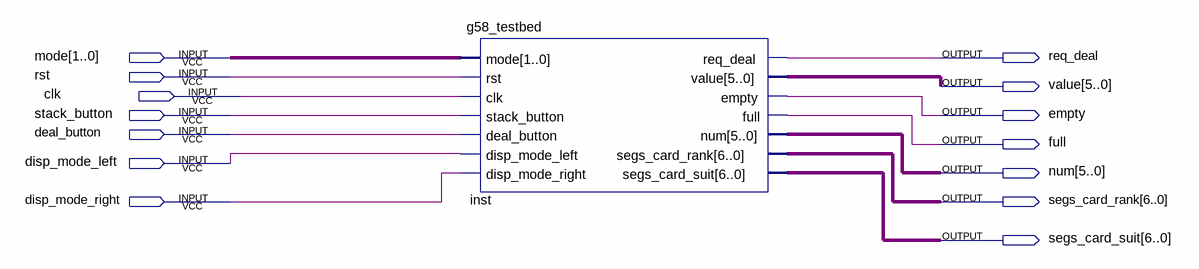
[diagram p0: schematic sheet]
// Quartus schematic g58_lab4.bdf as structural Verilog: 1 symbols, 14 pins
module g58_lab4 (
  input  [1:0] mode,
  input  rst,
  input  clk,
  input  stack_button,
  input  deal_button,
  input  disp_mode_left,
  input  disp_mode_right,
  output req_deal,
  output [5:0] value,
  output empty,
  output full,
  output [5:0] num,
  output [6:0] segs_card_rank,
  output [6:0] segs_card_suit
);

  g58_testbed inst (
    .mode(mode), .rst(rst), .clk(clk), .stack_button(stack_button), .deal_button(deal_button),
    .disp_mode_left(disp_mode_left), .disp_mode_right(disp_mode_right), .req_deal(req_deal), .value(value),
    .empty(empty), .full(full), .num(num), .segs_card_rank(segs_card_rank), .segs_card_suit(segs_card_suit));
endmodule
